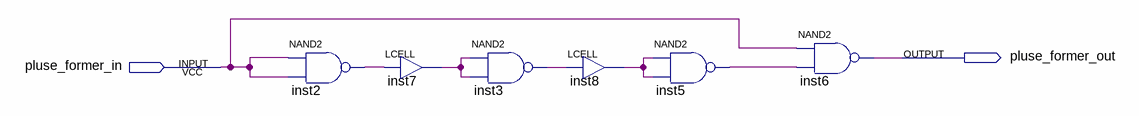
[diagram p0: schematic sheet]
// Quartus schematic pluse_former.bdf as structural Verilog: 6 symbols, 2 pins
module pluse_former (
  input  pluse_former_in,
  output pluse_former_out
);

  wire inst2_out, inst3_out, inst5_out, inst7_out, inst8_out;

  nand inst2 (inst2_out, pluse_former_in, pluse_former_in);
  LCELL inst7 (.IN(inst2_out), .OUT(inst7_out));
  nand inst3 (inst3_out, inst7_out, inst7_out);
  LCELL inst8 (.IN(inst3_out), .OUT(inst8_out));
  nand inst5 (inst5_out, inst8_out, inst8_out);
  nand inst6 (pluse_former_out, pluse_former_in, inst5_out);
endmodule
